# EAGLE schematic XMICRO-PROTO (EAGLE 6.3)
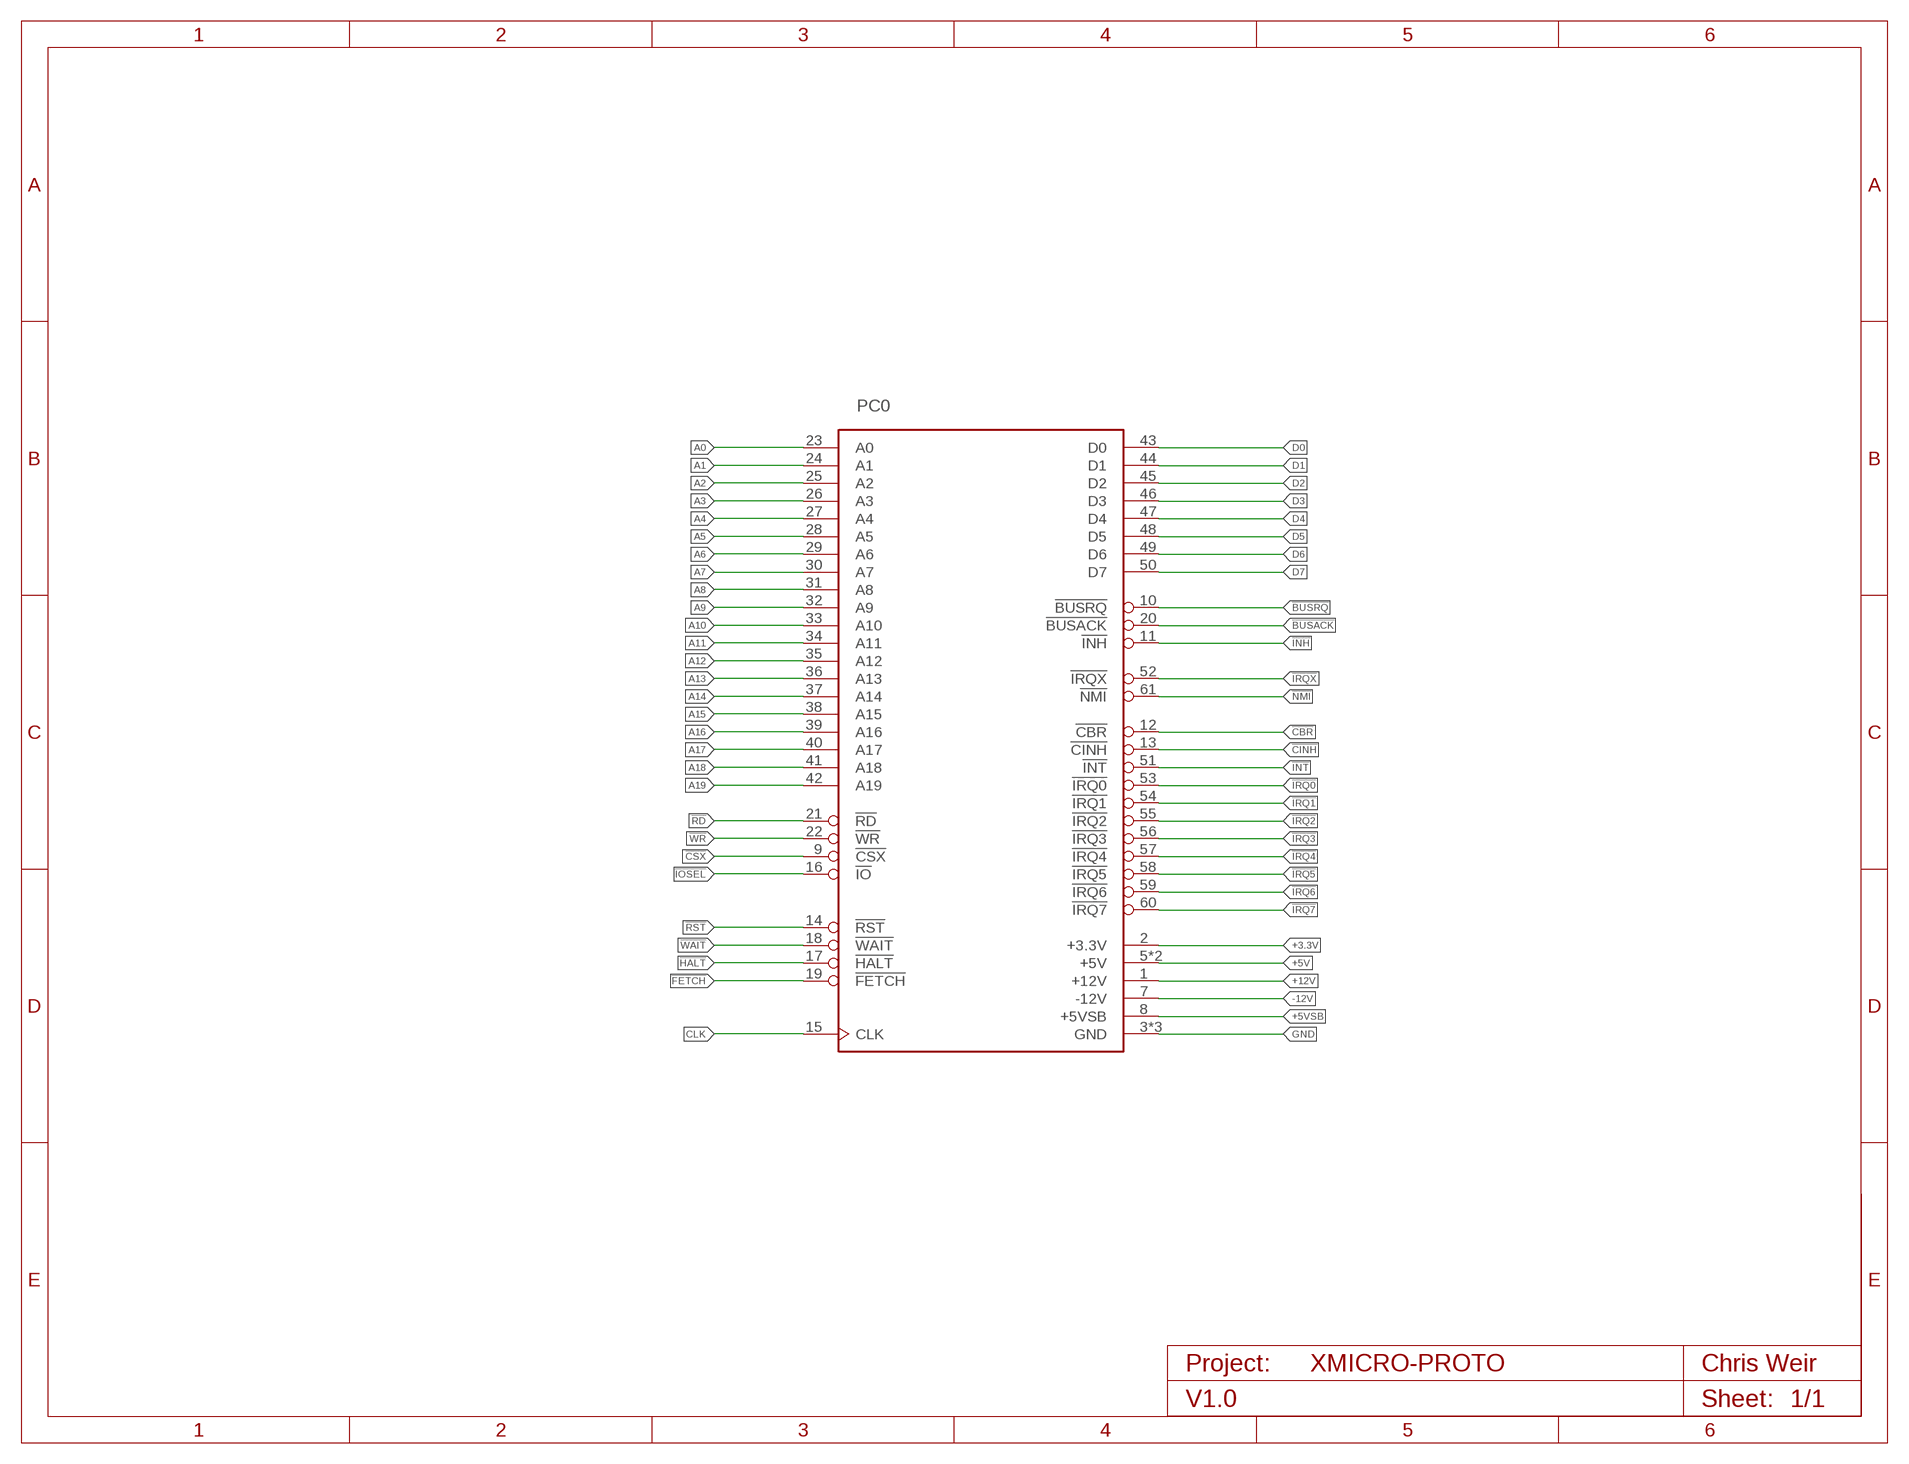
[diagram p0: schematic, sheet 1]

## Parts
PC0  XMICRO-BUS-EDGE62M  [EDGE62M]

## Nets
!BUSACK: PC0.20(!BUSACK)
!BUSRQ: PC0.10(!BUSRQ)
!CBR: PC0.12(!CBR)
!CINH: PC0.13(!CINH)
!CSX: PC0.9(!CSX)
!FETCH: PC0.19(!FETCH)
!HALT: PC0.17(!HALT)
!INH: PC0.11(!INH)
!INT: PC0.51(!INT)
!IOSEL: PC0.16(!IO)
!IRQ0: PC0.53(!IRQ0)
!IRQ1: PC0.54(!IRQ1)
!IRQ2: PC0.55(!IRQ2)
!IRQ3: PC0.56(!IRQ3)
!IRQ4: PC0.57(!IRQ4)
!IRQ5: PC0.58(!IRQ5)
!IRQ6: PC0.59(!IRQ6)
!IRQ7: PC0.60(!IRQ7)
!IRQX: PC0.52(!IRQX)
!NMI: PC0.61(!NMI)
!RD: PC0.21(!RD)
!RST: PC0.14(!RST)
!WAIT: PC0.18(!WAIT)
!WR: PC0.22(!WR)
+3.3V: PC0.2(+3.3V)
+5V [+5V]: PC0.5(+5V) PC0.6(+5V)
+5VSB: PC0.8(+5VSB)
+12V: PC0.1(+12V)
-12V: PC0.7(-12V)
A0: PC0.23(A0)
A1: PC0.24(A1)
A2: PC0.25(A2)
A3: PC0.26(A3)
A4: PC0.27(A4)
A5: PC0.28(A5)
A6: PC0.29(A6)
A7: PC0.30(A7)
A8: PC0.31(A8)
A9: PC0.32(A9)
A10: PC0.33(A10)
A11: PC0.34(A11)
A12: PC0.35(A12)
A13: PC0.36(A13)
A14: PC0.37(A14)
A15: PC0.38(A15)
A16: PC0.39(A16)
A17: PC0.40(A17)
A18: PC0.41(A18)
A19: PC0.42(A19)
CLK: PC0.15(CLK)
D0: PC0.43(D0)
D1: PC0.44(D1)
D2: PC0.45(D2)
D3: PC0.46(D3)
D4: PC0.47(D4)
D5: PC0.48(D5)
D6: PC0.49(D6)
D7: PC0.50(D7)
GND [GND]: PC0.3(GND) PC0.4(GND) PC0.62(GND)

## Notes on the sheet
- Project: | Chris Weir
- V1.0 | Sheet:

## Library data of the parts
PC0 = Custom:XMICRO-BUS

## Net classes
0 default: width 0.254 mm, clearance 0.305 mm
1 GND: width 0.254 mm, clearance 0.305 mm to class 0, clearance 0.305 mm
2 +5V: width 0.254 mm, clearance 0.305 mm to class 0, clearance 0.381 mm to class 1, clearance 0.305 mm